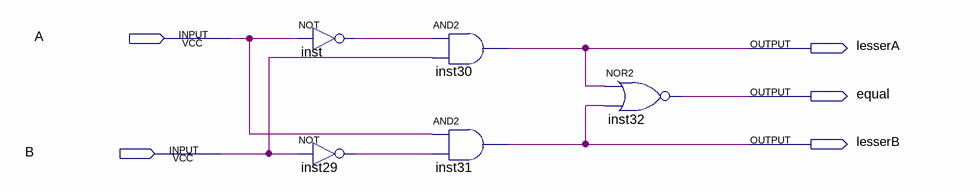
[diagram p0: schematic sheet]
// Quartus schematic comparator.bdf as structural Verilog: 5 symbols, 5 pins
module comparator (
  input  A,
  input  B,
  output lesserA,
  output equal,
  output lesserB
);

  wire inst29_out, inst_out;

  not inst (inst_out, A);
  not inst29 (inst29_out, B);
  and inst30 (lesserA, inst_out, B);
  and inst31 (lesserB, A, inst29_out);
  nor inst32 (equal, lesserA, lesserB);
endmodule
